# EAGLE design doubleTiny (EAGLE 7.2.0)
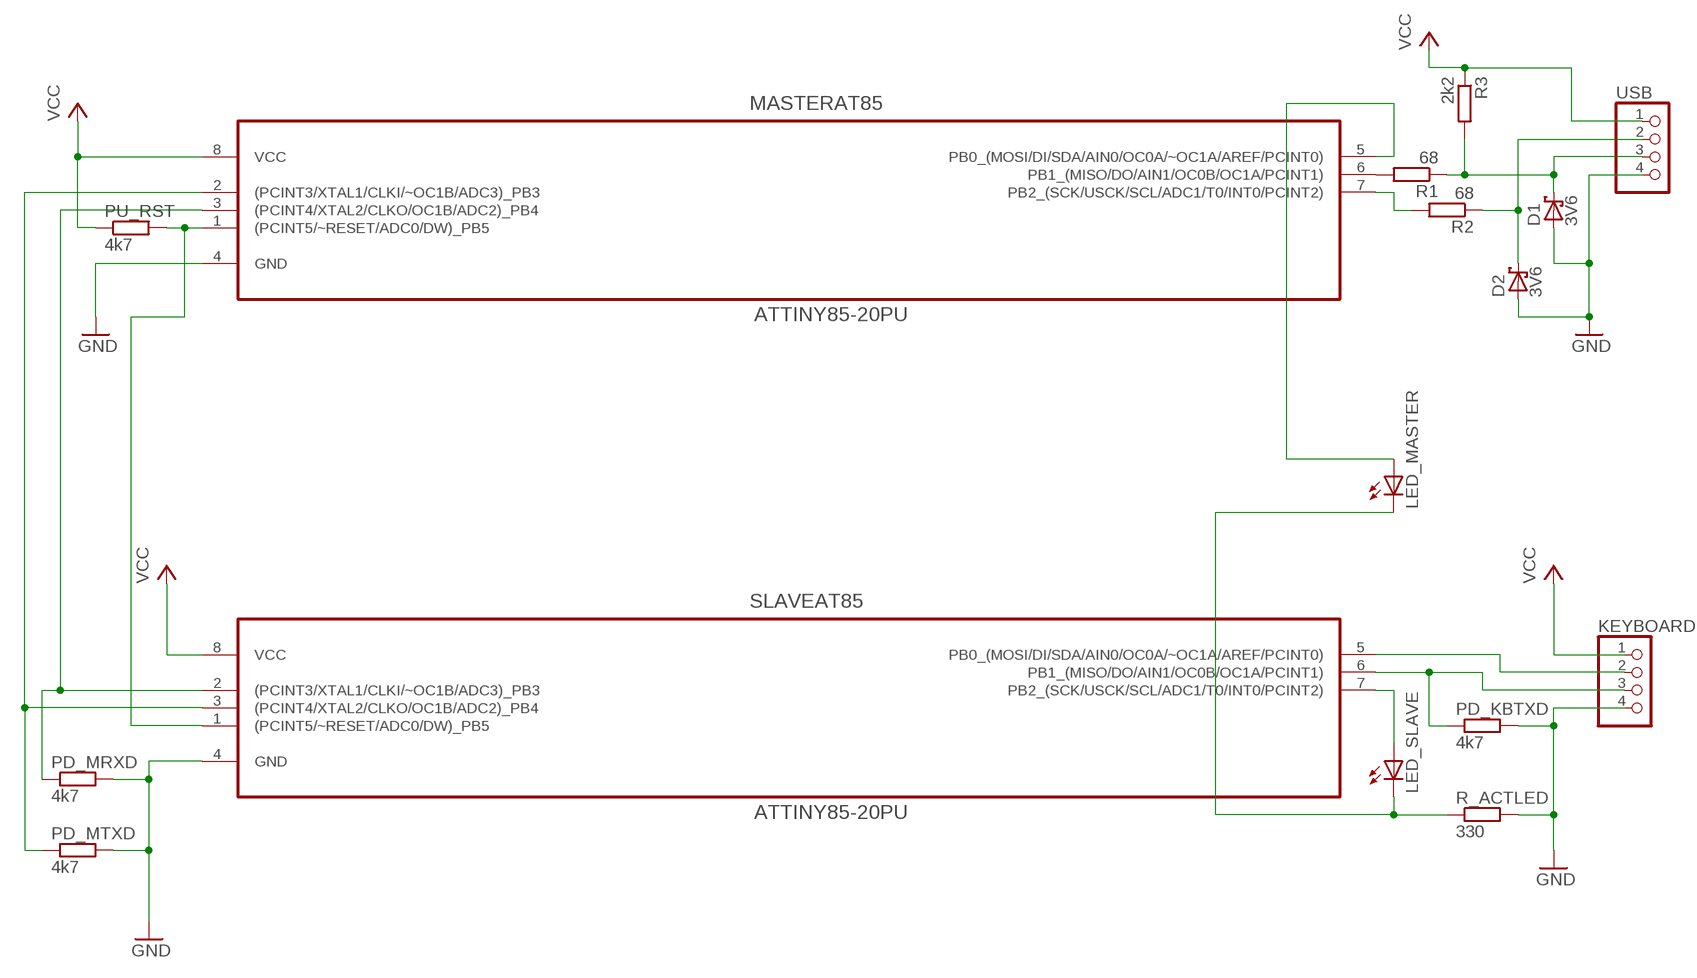
[diagram p0: schematic, sheet 1]

## Parts
D1  3V6  1N5908  [C4111-15]
D2  3V6  1N5908  [C4111-15]
KEYBOARD  PINHD-1X4  [1X04]
LED_MASTER  LED3MM  [LED3MM]
LED_SLAVE  LED5MM  [LED5MM]
MASTERAT85  ATTINY85-20PU  [DIP254P762X533-8]
PD_KBTXD  4k7  R-EU_0309/12  [0309/12]
PD_MRXD  4k7  R-EU_0309/12  [0309/12]
PD_MTXD  4k7  R-EU_0309/12  [0309/12]
PU_RST  4k7  R-EU_0309/12  [0309/12]
R1  68  R-EU_0309/12  [0309/12]
R2  68  R-EU_0309/12  [0309/12]
R3  2k2  R-EU_0309/12  [0309/12]
R_ACTLED  330  R-EU_0309/12  [0309/12]
SLAVEAT85  ATTINY85-20PU  [DIP254P762X533-8]
USB  PINHD-1X4  [1X04]

## Nets
GND: D1.A D2.A KEYBOARD.4 MASTERAT85.4(GND) PD_KBTXD.2 PD_MRXD.2 PD_MTXD.2 R_ACTLED.2 SLAVEAT85.4(GND) USB.4
N$1: MASTERAT85.7(PB2_(SCK/USCK/SCL/ADC1/T0/INT0/PCINT2)) R2.2
N$2: MASTERAT85.6(PB1_(MISO/DO/AIN1/OC0B/OC1A/PCINT1)) R1.2
N$3: D1.C R1.1 R3.2 USB.3
N$4: D2.C R2.1 USB.2
N$5: KEYBOARD.2 SLAVEAT85.5(PB0_(MOSI/DI/SDA/AIN0/OC0A/~OC1A/AREF/PCINT0))
N$6: MASTERAT85.3((PCINT4/XTAL2/CLKO/OC1B/ADC2)_PB4) PD_MRXD.1 SLAVEAT85.2((PCINT3/XTAL1/CLKI/~OC1B/ADC3)_PB3)
N$7: MASTERAT85.2((PCINT3/XTAL1/CLKI/~OC1B/ADC3)_PB3) PD_MTXD.1 SLAVEAT85.3((PCINT4/XTAL2/CLKO/OC1B/ADC2)_PB4)
N$8: KEYBOARD.3 PD_KBTXD.1 SLAVEAT85.6(PB1_(MISO/DO/AIN1/OC0B/OC1A/PCINT1))
N$9: MASTERAT85.1((PCINT5/~RESET/ADC0/DW)_PB5) PU_RST.2 SLAVEAT85.1((PCINT5/~RESET/ADC0/DW)_PB5)
N$10: LED_MASTER.A MASTERAT85.5(PB0_(MOSI/DI/SDA/AIN0/OC0A/~OC1A/AREF/PCINT0))
N$11: LED_SLAVE.A SLAVEAT85.7(PB2_(SCK/USCK/SCL/ADC1/T0/INT0/PCINT2))
N$12: LED_MASTER.K(C) LED_SLAVE.K(C) R_ACTLED.1
VCC: KEYBOARD.1 MASTERAT85.8(VCC) PU_RST.1 R3.1 SLAVEAT85.8(VCC) USB.1

## Library data of the parts
D1 D2 = diode:1N5908: DIODE schottky
KEYBOARD USB = pinhead:PINHD-1X4: PIN HEADER
LED_MASTER LED_SLAVE = led:LED: LED OSRAM: - CHIPLED LG R971, LG N971, LY N971, LG Q971, LY Q971, LO R971, LY R971 LH N974, LH R974 LS Q976, LO Q976, LY Q976 LO Q996 - Hyper CHIPLED LW Q18S LB Q993, LB Q99A, LB R99A - SideLED LS A670, LO A670, LY A670, LG A670, LP A670 LB A673, LV A673, LT A673, LW A673 LH A674 LY A675 LS A676, LA A676, LO A676, LY A676, LW A676 LS A679, LY A679, LG A679 - Hyper Micro SIDELED® LS Y876, LA Y876, LO Y876, LY Y876 LT Y87S - SmartLED LW L88C, LW L88S LB L89C, LB L89S, LG L890 LS L89K, LO L89K, LY L89K LS L896, LA L896, LO L896, LY L896 - TOPLED LS T670, LO T670, LY T670, LG T670, LP T670 LSG T670, LSP T670, LSY T670, LOP T670, LYG T670 LG T671, LOG T671, LSG T671 LB T673, LV T673, LT T673, LW T673 LH T674 LS T676, LA T676, LO T676, LY T676, LB T676, LH T676, LSB T676, LW T676 LB T67C, LV T67C, LT T67C, LS T67K, LO T67K, LY T67K, LW E67C LS E67B, LA E67B, LO E67B, LY E67B, LB E67C, LV E67C, LT E67C LW T67C LS T679, LY T679, LG T679 LS T770, LO T770, LY T770, LG T770, LP T770 LB T773, LV T773, LT T773, LW T773 LH T774 LS E675, LA E675, LY E675, LS T675 LS T776, LA T776, LO T776, LY T776, LB T776 LHGB T686 LT T68C, LB T68C - Hyper Mini TOPLED® LB M676 - Mini TOPLED Santana® LG M470 LS M47K, LO M47K, LY M47K Source: http://www.osram.convergy.de LUXEON: - LUMILED® LXK2-PW12-R00, LXK2-PW12-S00, LXK2-PW14-U00, LXK2-PW14-V00 LXK2-PM12-R00, LXK2-PM12-S00, LXK2-PM14-U00 LXK2-PE12-Q00, LXK2-PE12-R00, LXK2-PE12-S00, LXK2-PE14-T00, LXK2-PE14-U00 LXK2-PB12-K00, LXK2-PB12-L00, LXK2-PB12-M00, LXK2-PB14-N00, LXK2-PB14-P00, LXK2-PB14-Q00 LXK2-PR12-L00, LXK2-PR12-M00, LXK2-PR14-Q00, LXK2-PR14-R00 LXK2-PD12-Q00, LXK2-PD12-R00, LXK2-PD12-S00 LXK2-PH12-R00, LXK2-PH12-S00 LXK2-PL12-P00, LXK2-PL12-Q00, LXK2-PL12-R00 Source: www.luxeon.com KINGBRIGHT: KA-3528ASYC Source: www.kingbright.com
MASTERAT85 SLAVEAT85 = Atmel_By_element14_Batch_1-00:ATTINY85-20PU: 8-bit Microcontroller with In-System Programmable Flash; MPN: ATTINY85-20PU; OC_FARNELL: 1455162; OC_NEWARK: 58M3796; PACKAGE: PDIP-8; SUPPLIER: Atmel
PD_KBTXD PD_MRXD PD_MTXD PU_RST R1-R3 R_ACTLED = resistor:R-EU_: RESISTOR, European symbol

## Board
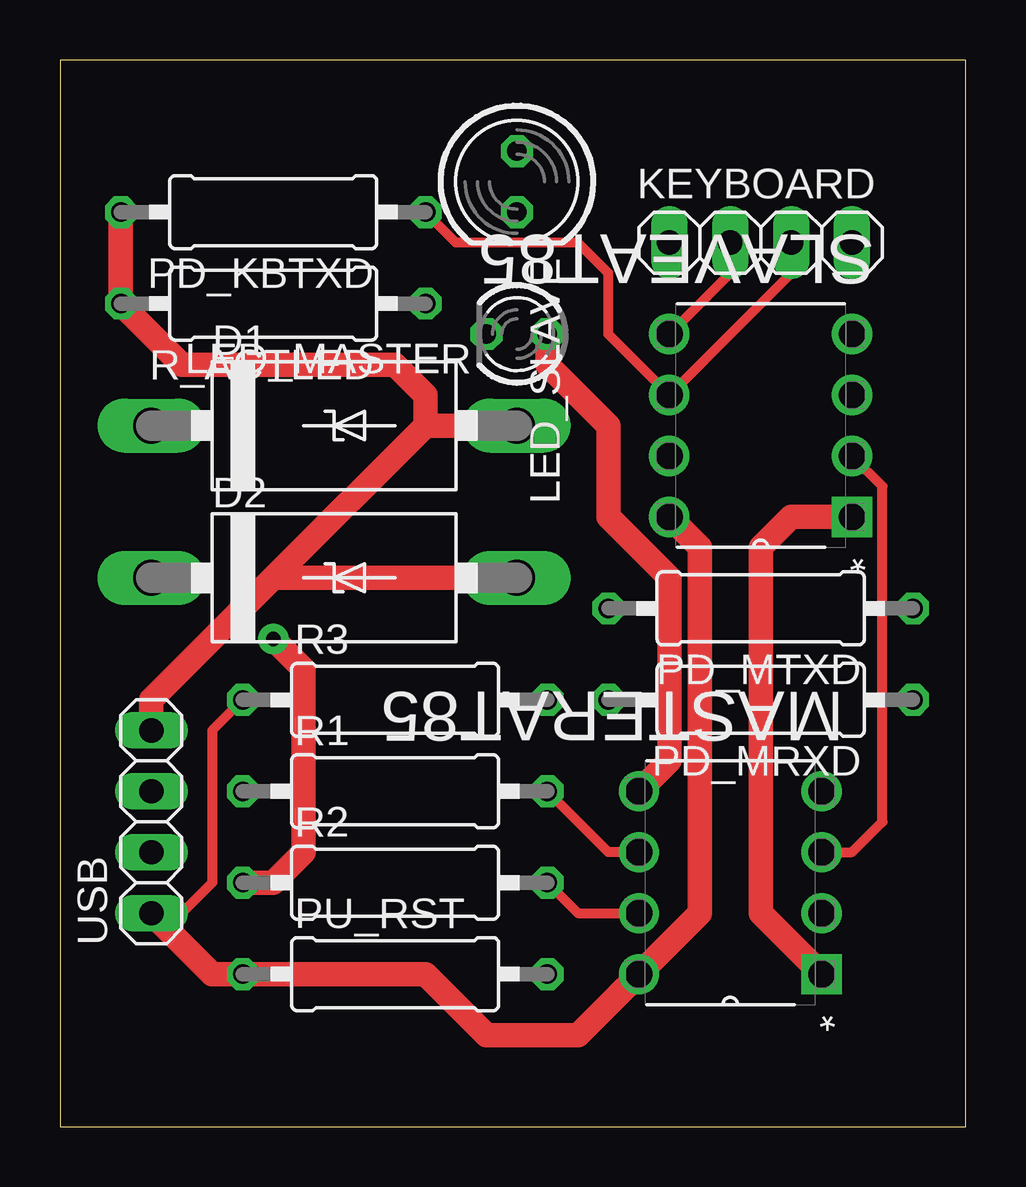
[diagram p1: board, top side]
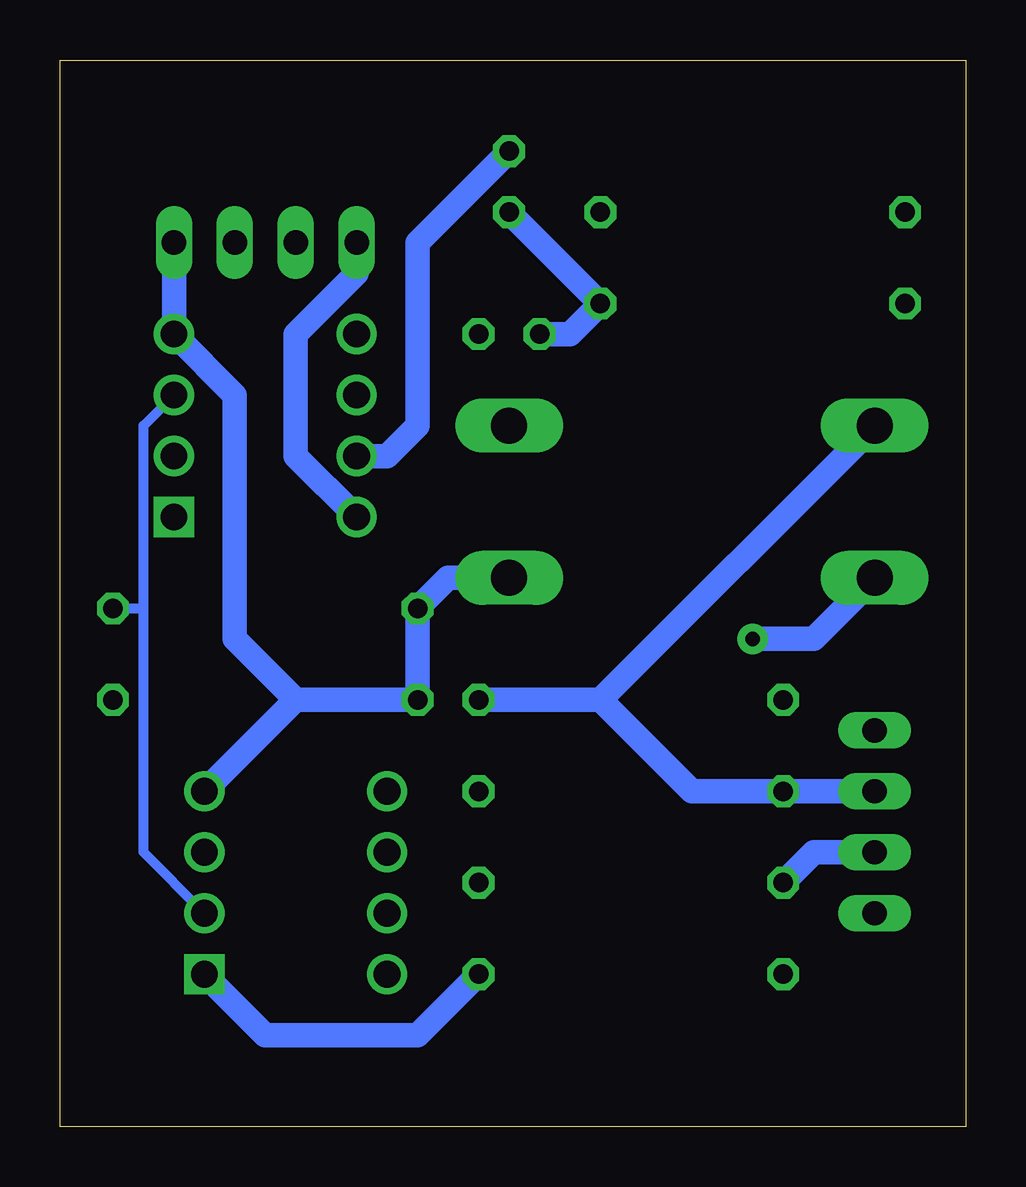
[diagram p2: board, bottom side, seen from below]

Size 37.77 x 44.44 mm. Coordinates in mm from the lower left corner, seen from the top.
Outline: 0,0 37.77,0 37.77,44.44 0,44.44 0,0
Copper layers (1*16): Top 0.035mm / dielectric 1.5mm / Bottom 0.035mm
Design rules "default": minimum track width 10mil, minimum drill 24mil, track to track 8mil, track to pad 8mil, pad to pad 8mil, via to via 8mil, smd to smd 8mil, copper to edge 40mil, drill to drill 8mil, minimum pad ring 10mil, minimum via ring 8mil, stop-mask expansion 4mil, vias tented up to drill 0mil, thermal gap 10mil

### Footprints (pad centres in the part's own frame; a part is rotated, then mirrored left to right if it is on the bottom)
C4111-15 = drill 1.499 long: A 7.62,0; C -7.62,0
1X04 = drill 1.016 long: 1 -3.81,0; 2 -1.27,0; 3 1.27,0; 4 3.81,0
LED3MM = drill 0.813 octagon: A -1.27,0; K 1.27,0
LED5MM = drill 0.813 octagon: A -1.27,0; K 1.27,0
DIP254P762X533-8 = drill 1.118 square: 1 -7.62,7.62 | drill 1.118: 2 -7.62,5.08; 3 -7.62,2.54; 4 -7.62,0; 5 0,0; 6 0,2.54; 7 0,5.08; 8 0,7.62
0309/12 = drill 0.813 octagon: 1 -6.35,0; 2 6.35,0

### Placement (x,y rotation side)
D1  11.43,29.21 0 top
D2  11.43,22.86 0 top
KEYBOARD  29.21,36.83 0 top
LED_MASTER  19.05,33.02 180 top
LED_SLAVE  19.05,39.37 270 top
MASTERAT85  24.13,13.97 180 top
PD_KBTXD  8.89,38.1 180 top
PD_MRXD  29.21,17.78 180 top
PD_MTXD  29.21,21.59 180 top
PU_RST  13.97,6.35 0 top
R1  13.97,13.97 0 top
R2  13.97,10.16 0 top
R3  13.97,17.78 0 top
R_ACTLED  8.89,34.29 180 top
SLAVEAT85  25.4,33.02 180 top
USB  3.81,12.7 90 top

### Tracks (layer width: path | path; a pad name or v marks a point on that pad's centre or on a via)
GND
  Top 1.016: USB.4 3.81,17.78 8.89,22.86 | 8.89,22.86 D2.A | D1.A 15.24,29.21 | 15.24,29.21 8.89,22.86 | PD_KBTXD.2 R_ACTLED.2 5.08,31.75 13.97,31.75 15.24,30.48 15.24,29.21
  Bottom 1.016: MASTERAT85.4 27.94,17.78 | 27.94,17.78 PD_MRXD.2 PD_MTXD.2 21.59,22.86 D2.A | KEYBOARD.4 SLAVEAT85.4 30.48,30.48 30.48,20.32 27.94,17.78
N$1
  Top 0.406: R2.2 21.59,8.89 MASTERAT85.7
N$2
  Top 0.406: MASTERAT85.6 22.86,11.43 R1.2
N$3
  Bottom 1.016: D1.C 15.24,17.78 | 15.24,17.78 R3.2 | 15.24,17.78 11.43,13.97 R1.1 USB.3
N$4  (via drill 0.6 pad 1.27)
  Top 1.016: v8.89,20.32 10.16,19.05 10.16,11.43 8.89,10.16 R2.1
  Bottom 1.016: USB.2 6.35,11.43 R2.1 | D2.C 6.35,20.32 v8.89,20.32
N$5
  Top 0.406: KEYBOARD.2 27.94,35.56 SLAVEAT85.5
N$6
  Top 0.406: MASTERAT85.3 33.02,11.43 34.29,12.7 34.29,17.78 | 34.29,17.78 34.29,26.67 SLAVEAT85.2 | PD_MRXD.1 34.29,17.78
N$7
  Bottom 0.406: MASTERAT85.2 34.29,11.43 34.29,21.59 | 34.29,21.59 34.29,29.21 SLAVEAT85.3 | PD_MTXD.1 34.29,21.59
N$8
  Top 0.406: KEYBOARD.3 30.48,35.56 SLAVEAT85.6 22.86,33.02 22.86,35.56 21.59,36.83 16.51,36.83 PD_KBTXD.1
N$9
  Top 1.016: SLAVEAT85.1 30.48,25.4 29.21,24.13 29.21,8.89 MASTERAT85.1
  Bottom 1.016: PU_RST.2 22.86,3.81 29.21,3.81 MASTERAT85.1
N$10
  Top 1.016: MASTERAT85.5 25.4,15.24 25.4,22.86 22.86,25.4 22.86,29.21 20.32,31.75 LED_MASTER.A
N$11
  Bottom 1.016: SLAVEAT85.7 24.13,27.94 22.86,29.21 22.86,36.83 LED_SLAVE.A
N$12
  Bottom 1.016: LED_MASTER.K 16.51,33.02 R_ACTLED.1 LED_SLAVE.K
VCC
  Top 0.406: R3.1 6.35,16.51 6.35,10.16 5.08,8.89 USB.1
  Top 1.016: SLAVEAT85.8 26.67,24.13 26.67,8.89 MASTERAT85.8 21.59,3.81 17.78,3.81 15.24,6.35 PU_RST.1 6.35,6.35 USB.1
  Bottom 1.016: KEYBOARD.1 25.4,35.56 27.94,33.02 27.94,27.94 SLAVEAT85.8